# Altium schematic sheet Main.SchDoc
size A3; SheetNumber: 1; SheetTotal: 2
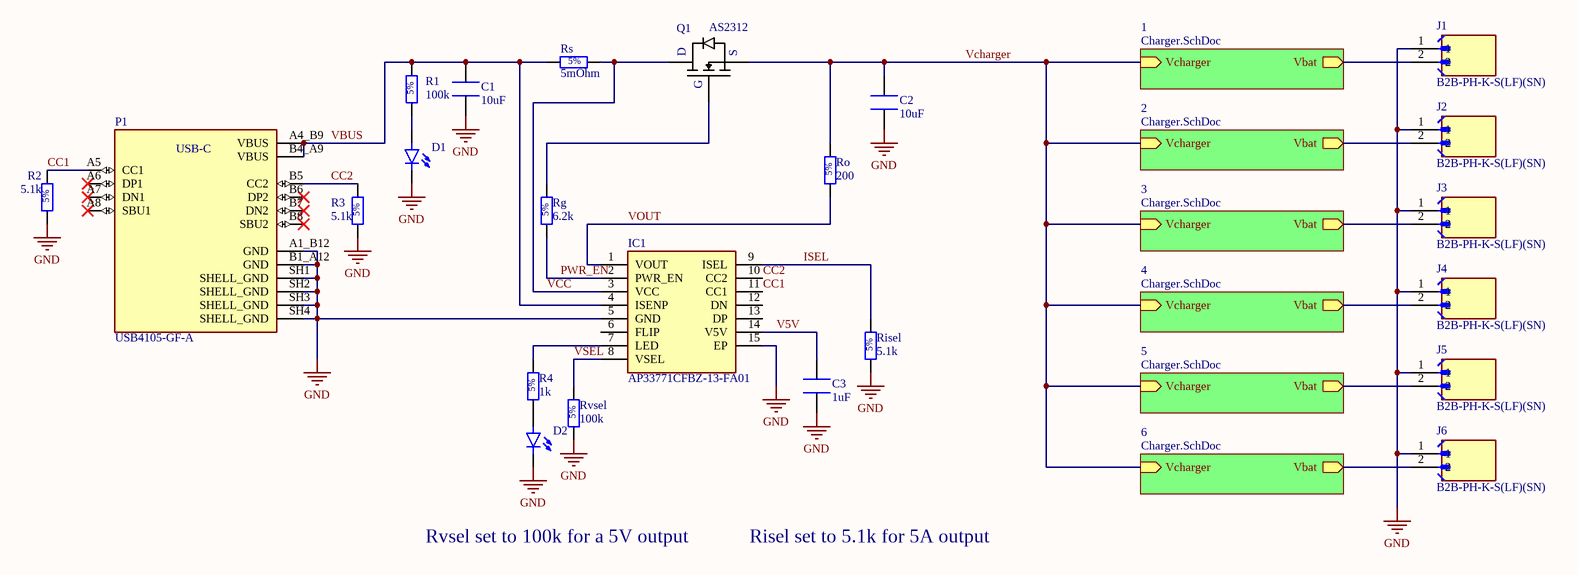
[diagram p0: Main.SchDoc]

## Parts
C1  10uF  [CAPACITOR_0805_2012M-70N]
C2  10uF  [CAPACITOR_0805_2012M-70N]
C3  1uF  [CAPACITOR_0805_2012M-70N]
D1  LTST-C190 Series  [LED_0603_1608M_0.80mm]  (value not drawn)
D2  LTST-C190 Series  [LED_0603_1608M_0.80mm]  (value not drawn)
IC1  AP33771CFBZ-13-FA01  [AP33771CFBZ13FA01]
J1  B2B-PH-K-S(LF)(SN)  [JST_B2B-PH-K-S(LF)(SN)]
J2  B2B-PH-K-S(LF)(SN)  [JST_B2B-PH-K-S(LF)(SN)]
J3  B2B-PH-K-S(LF)(SN)  [JST_B2B-PH-K-S(LF)(SN)]
J4  B2B-PH-K-S(LF)(SN)  [JST_B2B-PH-K-S(LF)(SN)]
J5  B2B-PH-K-S(LF)(SN)  [JST_B2B-PH-K-S(LF)(SN)]
J6  B2B-PH-K-S(LF)(SN)  [JST_B2B-PH-K-S(LF)(SN)]
P1  USB4105-GF-A  [GCT_USB4105-GF-A]
Q1  AS2312  [SOT23-3N-1.15mm]
R1  100k  [Resistor_0805_2012M-50N]
R2  5.1k  [Resistor_0805_2012M-50N]
R3  5.1k  [Resistor_0805_2012M-50N]
R4  1k  [Resistor_0805_2012M-50N]
Rg  6.2k  [Resistor_0805_2012M-50N]
Risel  5.1k  [Resistor_0805_2012M-50N]
Ro  200  [Resistor_0805_2012M-50N]
Rs  5mOhm  [Resistor_0805_2012M-50N]
Rvsel  100k  [Resistor_0805_2012M-50N]

## Sub-sheets
1 = Charger.SchDoc: Vcharger (in), Vbat (out)
2 = Charger.SchDoc: Vcharger (in), Vbat (out)
3 = Charger.SchDoc: Vcharger (in), Vbat (out)
4 = Charger.SchDoc: Vcharger (in), Vbat (out)
5 = Charger.SchDoc: Vcharger (in), Vbat (out)
6 = Charger.SchDoc: Vcharger (in), Vbat (out)

## Nets
GND: C1.1 C2.1 C3.1 D1.C D2.C IC1.5(GND) IC1.15(EP) J1.1 J2.1 J3.1 J4.1 J5.1 J6.1 P1.A1_B12(GND) P1.B1_A12(GND) P1.SH1(SHELL_GND) P1.SH2(SHELL_GND) P1.SH3(SHELL_GND) P1.SH4(SHELL_GND) R2.1 R3.1 Risel.1 Rvsel.1
CC1: IC1.11(CC1) P1.A5(CC1) R2.2
CC2: IC1.10(CC2) P1.B5(CC2) R3.2
ISEL: IC1.9(ISEL) Risel.2
PWR_EN: IC1.2(PWR_EN) Rg.1
V5V: C3.2 IC1.14(V5V)
VBUS: C1.2 IC1.4(ISENP) P1.A4_B9(VBUS) P1.B4_A9(VBUS) R1.2 Rs.1
VCC: IC1.3(VCC) Q1.3(D) Rs.2
Vcharger: C2.2 Q1.2(S) Ro.2 ; sheet 2/Vcharger, sheet 3/Vcharger, sheet 4/Vcharger, sheet 5/Vcharger, sheet 6/Vcharger, sheet 1/Vcharger
VOUT: IC1.1(VOUT) Ro.1
VSEL: IC1.8(VSEL) Rvsel.2
NetD1_A: D1.A R1.1
NetD2_A: D2.A R4.1
NetIC1_7: IC1.7(LED) R4.2
NetJ1_2: J1.2 ; sheet 1/Vbat
NetJ2_2: J2.2 ; sheet 2/Vbat
NetJ3_2: J3.2 ; sheet 3/Vbat
NetJ4_2: J4.2 ; sheet 4/Vbat
NetJ5_2: J5.2 ; sheet 5/Vbat
NetJ6_2: J6.2 ; sheet 6/Vbat
NetQ1_1: Q1.1(G) Rg.2

Not connected (* = marked no-connect by the designer): IC1 6(FLIP) 12(DN) 13(DP); P1 A6(DP1)* A7(DN1)* A8(SBU1)* B6(DP2)* B7(DN2)* B8(SBU2)*

## Notes on the sheet
- (near P1) USB-C
- Rvsel set to 100k for a 5V output
- Risel set to 5.1k for 5A output

## Library data of the parts
C1-C3 = GRM21BR60J107ME15L: Passive - Capacitor, 0805, 100uF Max, X5R, 6.3V ±20%, -55°C ~ 85°C, 0805 (2012 Metric). 20uF @ 6.3V; APSS Standard Part: APSS Standard; Tolerance: ±20%; Temperature Coefficient: X5R; Capacitance at Rated Voltage: 20%; Rated Voltage: 6.3V; Temp Range: -55°C ~ 85°C; Package: 0805; Supplier 1: Digikey; Supplier 1 Part No.: 490-GRM155R61E225KE11JCT-ND; MF Part No.: GRM21BR60J107ME15L
  C1 C2: Value: 10uF
  C3: Value: 1uF
D1 D2 = LTST-C190 Series: Diode - LED, 0603; APSS Standard Part: APSS Standard; Temp Range: -30°C ~ 85°C; Rated Voltage: 5V Reverse; Package: 0603; Supplier 1: Digikey; MF Part No.: *; Colour: *
IC1 = AP33771CFBZ-13-FA01: Integrated Circuit; Manufacturer_Name: Diodes Incorporated; Datasheet Link: https://www.diodes.com/datasheet/download/AP33771C.pdf; Height: 0.8mm; Manufacturer_Part_Number: AP33771CFBZ-13-FA01; Mouser Part Number: 621-P33771CFBZ13FA01; Mouser Price/Stock: https://www.mouser.co.uk/ProductDetail/Diodes-Incorporated/AP33771CFBZ-13-FA01?qs=2wMNvWM5ZX7JpCFGcPz6nw%3D%3D; Arrow Part Number: AP33771CFBZ-13-FA01; Arrow Price/Stock: https://www.arrow.com/en/products/ap33771cfbz-13-fa01/diodes-incorporated?utm_currency=USD&region=nac
J1-J6 = B2B-PH-K-S(LF)(SN): Connector Header Through Hole 2 position 0.079 (2.00mm); MF: JST; SnapEDA_Link: https://www.snapeda.com/parts/B2B-PH-K-S%20(LF)(SN)/JST/view-part/?ref=snap; Package: None; Value: *; MP: B2B-PH-K-S (LF)(SN); Check_prices: https://www.snapeda.com/parts/B2B-PH-K-S%20(LF)(SN)/JST/view-part/?ref=eda
P1 = USB4105-GF-A: USB-C (USB TYPE-C) USB 2.0 Receptacle Connector 24 (16+8 Dummy) Position Surface Mount, Right Angle; Through Hole; MF Part No.: USB4105-GF-A; Supplier 1 Part No.: 2073-USB4105-GF-ACT-ND; Supplier 1: Digikey
Q1 = AS2312: Transistor - MOSFET, N-Channel AS2312; APSS Standard Part: APSS Standard; Temp Range: 0°C ~ 150°C (TJ); Rated Voltage: 20 Vds; Power: 1.2W; MF Part No.: AS2312; Package: SOT-23-3; Supplier 1: Digikey; Supplier 1 Part No.: 4530-AS2312CT-ND
R1-R4 Rg Risel Ro Rs Rvsel = RMCF0805JT Series: Passive - Resistor Series, 0805, 5%, 100m - 22M, E24, 0.063W, 1/16W, ±200ppm/°C, -55°C ~ 155°C, 0805 (2012 Metric); APSS Standard Part: APSS Standard; Power: 1/8W; Value Range: 100m ~ 22M; Rated Voltage: 150V; Tolerance: 5%; E Series: E24; Temp Range: -55°C ~ 155°C; Supplier 1: Digikey; Package: 0805; Temperature Coefficient: ±200ppm/°C; MF Part No.: *
  R1 Rvsel: Value: 100k
  R2 R3 Risel: Value: 5.1k
  R4: Value: 1k
  Rg: Value: 6.2k
  Ro: Value: 200
  Rs: Value: 5mOhm